# EAGLE design MeteoV4.0 (EAGLE 9.6.1)
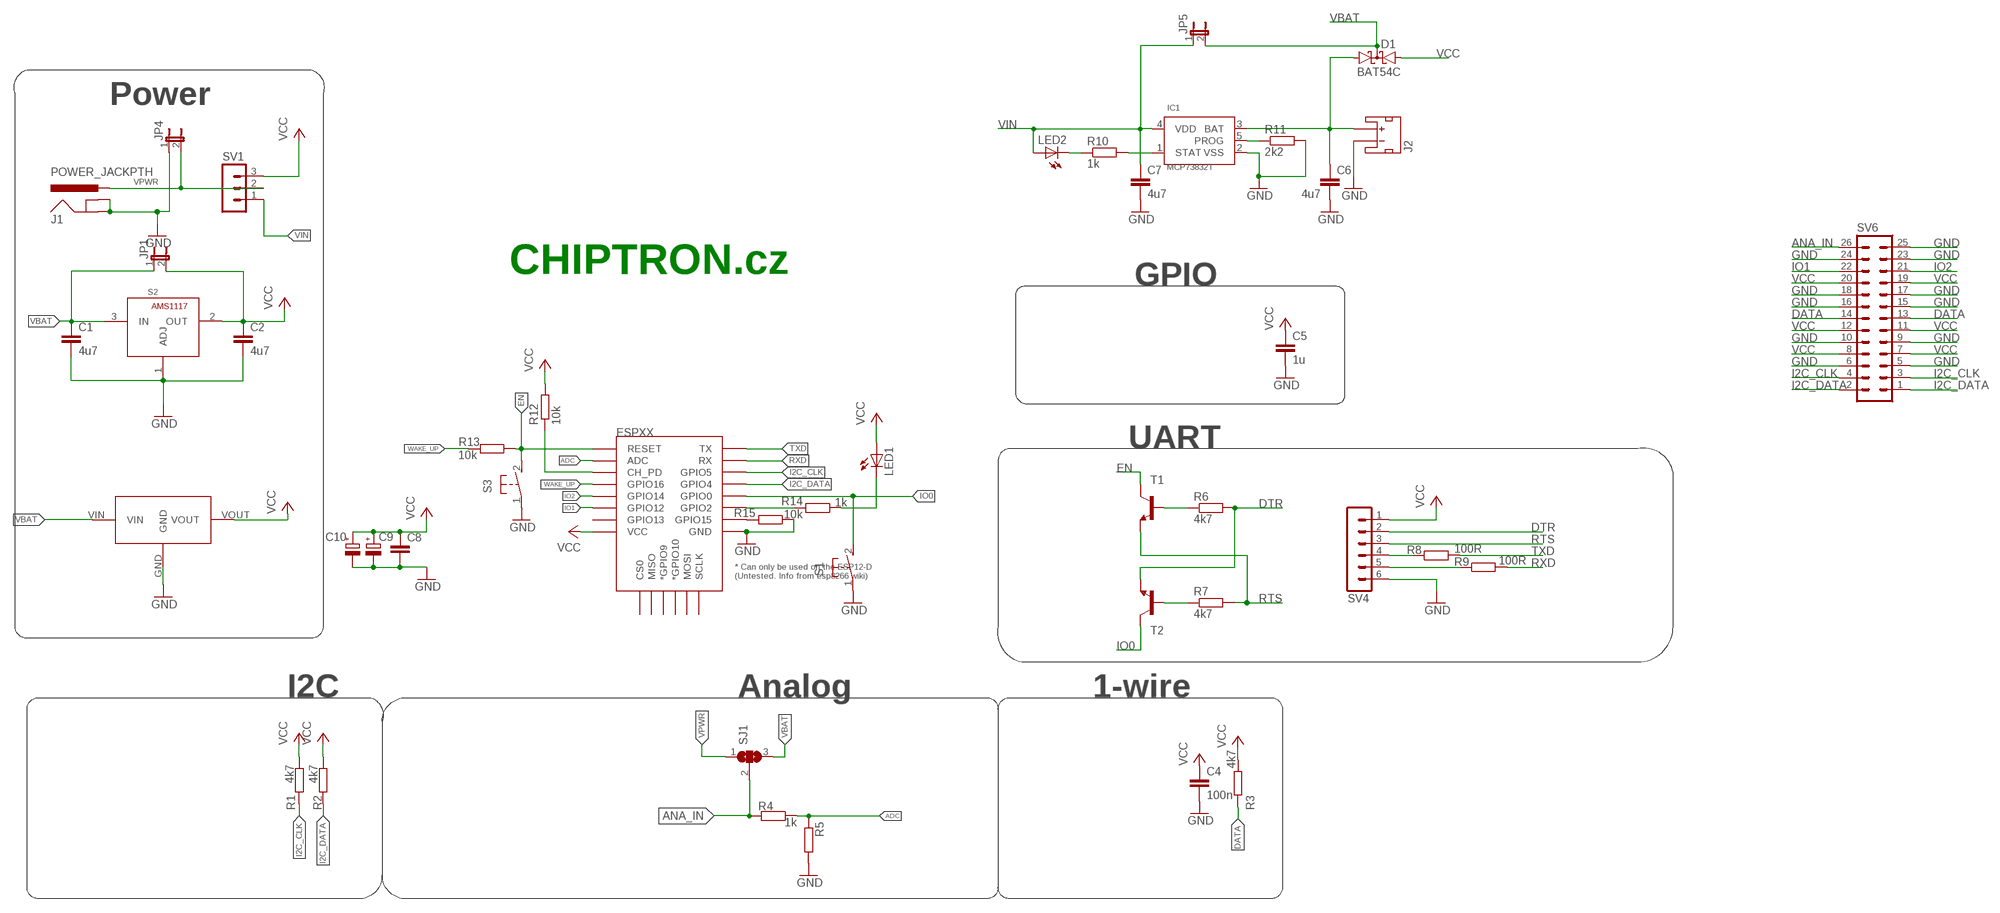
[diagram p0: schematic, sheet 1]

## Parts
C1  4u7  C-EUC0805  [C0805]
C2  4u7  C-EUC0805  [C0805]
C4  100n  C-EUC0805  [C0805]
C5  1u  C-EUC0805  [C0805]
C6  4u7  C-EUC0805  [C0805]
C7  4u7  C-EUC0805  [C0805]
C8  C-EUC0805  [C0805]
C9  CPOL-EUSMCB  [SMC_B]
C10  CPOL-EUSMCC  [SMC_C]
D1  BAT54C  [SOT23]
ESPXX  ESP12ESMD  [ESP12E-SMD]
IC1  MCP73832T  [SOT23-5]
J1  POWER_JACKPTH  [POWER_JACK_PTH]
J2  JST_2MM_MALE  [JST-2-SMD]
JP1  JP1E  [JP1]
JP4  JP1E  [JP1]
JP5  JP1E  [JP1]
LED1  LEDCHIP-LED0805  [CHIP-LED0805]
LED2  LEDCHIP-LED0805  [CHIP-LED0805]
R1  4k7  R-EU_M0805  [M0805]
R2  4k7  R-EU_M0805  [M0805]
R3  4k7  R-EU_M0805  [M0805]
R4  1k  R-EU_M0805  [M0805]
R5  R-EU_M0805  [M0805]
R6  4k7  R-EU_M0805  [M0805]
R7  4k7  R-EU_M0805  [M0805]
R8  100R  R-EU_M0805  [M0805]
R9  100R  R-EU_M0805  [M0805]
R10  1k  R-EU_M0805  [M0805]
R11  2k2  R-EU_M0805  [M0805]
R12  10k  R-EU_M0805  [M0805]
R13  10k  R-EU_M0805  [M0805]
R14  1k  R-EU_M0805  [M0805]
R15  10k  R-EU_M0805  [M0805]
S1  31-XX  [B3F-31XX]
S2  AMS1117  [SOT-223-3]
S3  31-XX  [B3F-31XX]
SJ1  SJ2W  [SJ_2]
SV1  MA03-1  [MA03-1]
SV4  MA06-1  [MA06-1]
SV6  MA13-2  [MA13-2]
T1  BC846-NPN-SOT23-BEC  [SOT23-BEC]
T2  BC846-NPN-SOT23-BEC  [SOT23-BEC]
U$1  HT7333  [SOT89]

## Nets
ADC: ESPXX.ADC R4.1 R5.1
ANA_IN: R4.2 SJ1.2 SV6.26
DATA: R3.1 SV6.13 SV6.14
DTR: R6.2 SV4.2 T2.E
EN: ESPXX.RESET R13.1 S3.2(S) T1.C
GND: C1.2 C2.2 C4.2 C5.2 C6.2 C7.2 C8.2 C9.- C10.- ESPXX.GND IC1.2(VSS) J1.GND J1.GNDBREAK J2.1(-) JP4.1 R5.2 R11.2 R15.1 S1.1(P) S2.1(ADJ) S3.1(P) SV4.6 SV6.5 SV6.6 SV6.9 SV6.10 SV6.15 SV6.16 SV6.17 SV6.18 SV6.23 SV6.24 SV6.25 U$1.GND
I2C_CLK: ESPXX.GPIO5 R1.1 SV6.3 SV6.4
I2C_DATA: ESPXX.GPIO4 R2.1 SV6.1 SV6.2
IO0: ESPXX.GPIO0 S1.2(S) T2.C
IO1: ESPXX.GPIO12 SV6.22
IO2: ESPXX.GPIO14 SV6.21
N$2: R7.1 T2.B
N$3: R8.1 SV4.4
N$4: R9.1 SV4.5
N$5: IC1.5(PROG) R11.1
N$7: ESPXX.CH_PD R12.1
N$8: LED1.C R14.1
N$9: ESPXX.GPIO15 R15.2
N$11: ESPXX.GPIO2 R14.2
N$12: R6.1 T1.B
N$14: IC1.1(STAT) R10.2
N$16: LED2.C R10.1
N$35: C6.1 D1.1(A1) IC1.3(BAT) J2.2(+)
RTS: R7.2 SV4.3 T1.E
RXD: ESPXX.RXD0(RX) R9.2
TXD: ESPXX.TXD0(TX) R8.2
VBAT: C1.1 D1.3(CC) JP1.1 JP5.2 S2.3(IN) SJ1.3 U$1.VIN
VCC: C2.1 C4.1 C5.1 C8.1 C9.+ C10.+ D1.2(A2) ESPXX.VCC JP1.2 LED1.A R1.2 R2.2 R3.2 R12.2 S2.2(OUT) SV1.3 SV4.1 SV6.7 SV6.8 SV6.11 SV6.12 SV6.19 SV6.20 U$1.VOUT
VIN: C7.1 IC1.4(VDD) JP5.1 LED2.A SV1.1
VPWR: J1.PWR JP4.2 SJ1.1 SV1.2
WAKE_UP: ESPXX.GPIO16 R13.2
Unconnected: ESPXX.CS0 ESPXX.GPIO9(*GPIO9) ESPXX.GPIO10(*GPIO10) ESPXX.GPIO13 ESPXX.MISO ESPXX.MOSI ESPXX.SCLK J2.NC1(PAD1) J2.NC2(PAD2)

## Notes on the sheet
- Power
- CHIPTRON.cz
- GPIO
- UART
- I2C | Analog | 1-wire

## Library data of the parts
C1 C2 C4-C8 = rcl:C-EU: CAPACITOR, European symbol; SPICEPREFIX: C
C9 C10 = rcl:CPOL-EU: POLARIZED CAPACITOR, European symbol; SPICEPREFIX: C
D1 = diode:BAT54C: Schottky Diodes Source: Fairchild .. BAT54.pdf
ESPXX = esp8266modules:ESP12E: ESP12E Module
IC1 = chiptron_cz:MCP73832T: MCP73832T
J1 = SparkFun:POWER_JACK: Power Jack This is the standard 5.5mm barrel jack for power. The PTH is the most common, proven, reliable, footprint. All others are experimental. The Slot footprint only works if the mill layer is transmitted to the PCB fab house so be warned. Spark Fun Electronics SKU : PRT-00119. Mating wall wart : TOL-00298 (and others)
J2 = SparkFun-connectors:JST_2MM_MALE: JST 2MM MALE RA CONNECTOR Two pin, compact surface mount connector. Commonly used as a battery input connection point. We really like the solid locking feeling and high current rating on these small connectors. We use these all the time as battery connectors. Mates to single-cell LiPo batteries. Here is the connector we sell at SparkFun: JST Right Angle Connector - White <https://www.sparkfun.com/products/8612> (PRT-08612) Datasheet <http://www.sparkfun.com/datasheets/Prototyping/Connectors/JST-Horizontal.pdf> It was used on these SparkFun products: SparkFun MOSFET Power Controller <https://www.sparkfun.com/products/11214> (PRT-11214) SparkFun Battery Babysitter - LiPo Battery Manager <https://www.sparkfun.com/products/13777> (PRT-13777) And many, many others that required a lipo battery connection.; PROD_ID: CONN-11443; SF_ID: PRT-08612
JP1 JP4 JP5 = jumper:JP1E: JUMPER
LED1 LED2 = adafruit:LED: LED OSRAM: - CHIPLED LG R971, LG N971, LY N971, LG Q971, LY Q971, LO R971, LY R971 LH N974, LH R974 LS Q976, LO Q976, LY Q976 LO Q996 - Hyper CHIPLED LW Q18S LB Q993, LB Q99A, LB R99A - SideLED LS A670, LO A670, LY A670, LG A670, LP A670 LB A673, LV A673, LT A673, LW A673 LH A674 LY A675 LS A676, LA A676, LO A676, LY A676, LW A676 LS A679, LY A679, LG A679 - Hyper Micro SIDELED® LS Y876, LA Y876, LO Y876, LY Y876 LT Y87S - SmartLED LW L88C, LW L88S LB L89C, LB L89S, LG L890 LS L89K, LO L89K, LY L89K LS L896, LA L896, LO L896, LY L896 - TOPLED LS T670, LO T670, LY T670, LG T670, LP T670 LSG T670, LSP T670, LSY T670, LOP T670, LYG T670 LG T671, LOG T671, LSG T671 LB T673, LV T673, LT T673, LW T673 LH T674 LS T676, LA T676, LO T676, LY T676, LB T676, LH T676, LSB T676, LW T676 LB T67C, LV T67C, LT T67C, LS T67K, LO T67K, LY T67K, LW E67C LS E67B, LA E67B, LO E67B, LY E67B, LB E67C, LV E67C, LT E67C LW T67C LS T679, LY T679, LG T679 LS T770, LO T770, LY T770, LG T770, LP T770 LB T773, LV T773, LT T773, LW T773 LH T774 LS E675, LA E675, LY E675, LS T675 LS T776, LA T776, LO T776, LY T776, LB T776 LHGB T686 LT T68C, LB T68C - Hyper Mini TOPLED® LB M676 - Mini TOPLED Santana® LG M470 LS M47K, LO M47K, LY M47K Source: http://www.osram.convergy.de/
R1-R15 = rcl:R-EU_: RESISTOR, European symbol; SPICEPREFIX: R
S1 S3 = switch-omron:31-XX: OMRON SWITCH; MPN: B3F-3100; OC_FARNELL: 959704; OC_NEWARK: 36M3582
S2 = fabo_powersupply:AMS1117
SJ1 = jumper:SJ2W: SMD solder JUMPER
SV1 = con-lstb:MA03-1: PIN HEADER; OC_FARNELL: unknown; OC_NEWARK: unknown
SV4 = con-lstb:MA06-1: PIN HEADER; OC_FARNELL: unknown; OC_NEWARK: unknown
SV6 = con-lstb:MA13-2: PIN HEADER; OC_FARNELL: unknown; OC_NEWARK: unknown
T1 T2 = transistor:*-NPN-: NPN Transistror BF959 corrected 2008.03.06
U$1 = HT7333_SOT89:HT7333

## Board
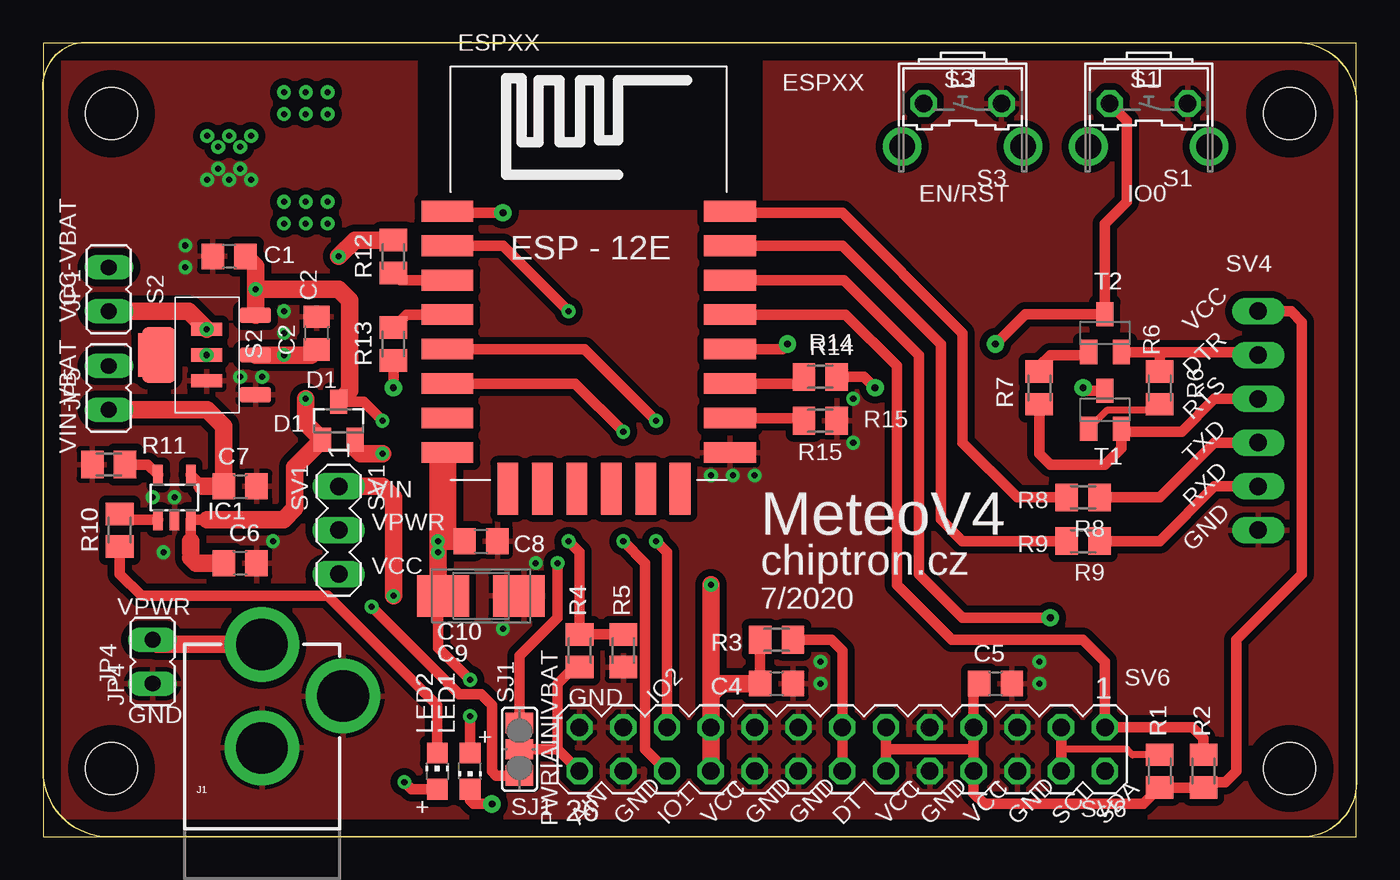
[diagram p1: board, top side]
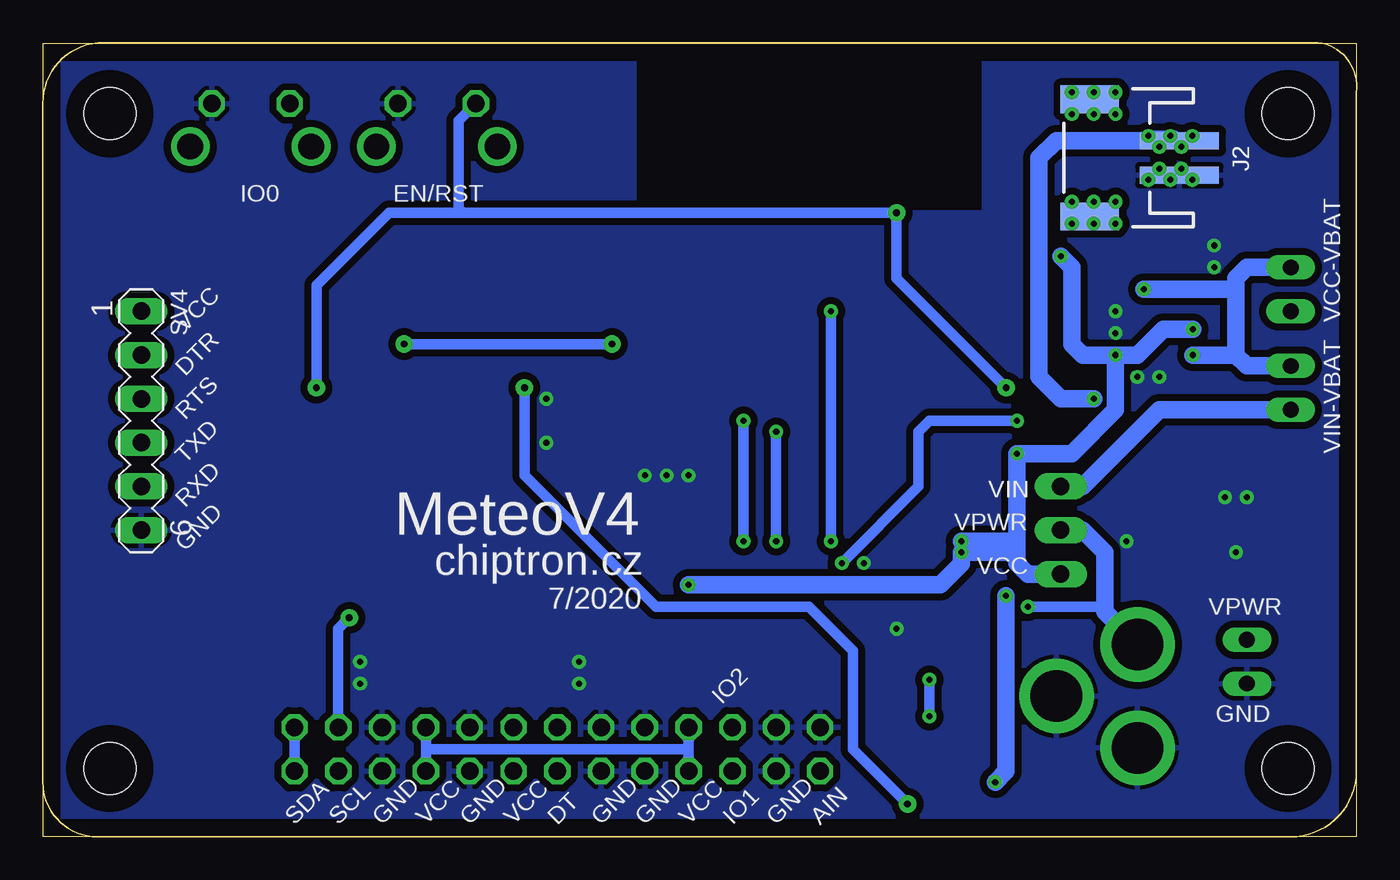
[diagram p2: board, bottom side, seen from below]

Size 76.18 x 46.02 mm. Coordinates in mm from the lower left corner, seen from the top.
Outline: 0,0 76.18,0 76.18,46.02 0,46.02 0,0
Copper layers (1*16): Top 0.035mm / dielectric 1.5mm / Bottom 0.035mm
Design rules "default": minimum track width 6mil, minimum drill 0.35mm, track to track 6mil, track to pad 6mil, pad to pad 6mil, via to via 6mil, smd to smd 6mil, copper to edge 40mil, drill to drill 6mil, minimum pad ring 10mil, minimum via ring 8mil, stop-mask expansion 4mil, vias tented up to drill 0mil, thermal gap 10mil
Holes 3 mm at 3.96,3.96 72.31,3.96 3.96,41.94 72.31,41.94
Milling: 8 lines

### Footprints (pad centres in the part's own frame; a part is rotated, then mirrored left to right if it is on the bottom)
C0805 = smd 1.3 x 1.5: 1 -0.95,0; 2 0.95,0
SMC_B = smd 1.6 x 2.4: + -1.5,0; - 1.5,0
SMC_C = smd 2.4 x 2.4: + -2.5,0; - 2.5,0
SOT23 = smd 1 x 1.4: 1 -0.95,-1.1; 2 0.95,-1.1; 3 0,1.1
ESP12E-SMD = smd 3 x 1.2: ADC -8.3,3.8; CH_PD -8.3,1.8; GND 8.1,-8.2; GPIO0 8.1,-2.2; GPIO2 8.1,-4.2; GPIO4 8.1,-0.2; GPIO5 8.1,1.8; GPIO12 -8.3,-4.2; GPIO13 -8.3,-6.2; GPIO14 -8.3,-2.2; GPIO15 8.1,-6.2; GPIO16 -8.3,-0.2; RESET -8.3,5.8; RXD0 8.1,3.8; TXD0 8.1,5.8; VCC -8.3,-8.2 | smd 1.2 x 3: CS0 -4.8,-10.3; GPIO9 -0.8,-10.3; GPIO10 1.2,-10.3; MISO -2.8,-10.3; MOSI 3.2,-10.3; SCLK 5.2,-10.3
SOT23-5 = smd 0.55 x 1.2: 1 -0.95,-1.3; 2 0,-1.3; 3 0.95,-1.3; 4 0.95,1.3; 5 -0.95,1.3
POWER_JACK_PTH = drill 2.997 pad 4.318: GND 0,7.7; GNDBREAK 4.7,10.7; PWR 0,13.7
JST-2-SMD = smd 1 x 4.6: 1 -1,-3.7; 2 1,-3.7 | smd 1.6 x 3.4: NC1 -3.4,1.5; NC2 3.4,1.5
JP1 = drill 0.914 long: 1 0,-1.27; 2 0,1.27
CHIP-LED0805 = smd 1.2 x 1.2: A 0,-1.05; C 0,1.05
M0805 = smd 1.3 x 1.6: 1 -0.95,0; 2 0.95,0
B3F-31XX = drill 1.016 octagon: 1 -2.261,-1.245; 2 2.261,-1.245 | drill 1.499 pad 2.159: 3 -3.505,1.245; 4 3.505,1.245
SOT-223-3 = smd 0.9 x 1.8: 1 -2.3,-2.8; 2 0,-2.8; 3 2.3,-2.8 | smd 3.2 x 1.9: 4 0,2.8
SJ_2 = smd 1.168 x 1.6: 1 -1.524,0; 2 0,0; 3 1.524,0
MA03-1 = drill 1.016 long: 1 -2.54,0; 2 0,0; 3 2.54,0
MA06-1 = drill 1.016 long: 1 -6.35,0; 2 -3.81,0; 3 -1.27,0; 4 1.27,0; 5 3.81,0; 6 6.35,0
MA13-2 = drill 1.016 octagon: 1 -15.24,-1.27; 2 -15.24,1.27; 3 -12.7,-1.27; 4 -12.7,1.27; 5 -10.16,-1.27; 6 -10.16,1.27; 7 -7.62,-1.27; 8 -7.62,1.27; 9 -5.08,-1.27; 10 -5.08,1.27; 11 -2.54,-1.27; 12 -2.54,1.27; 13 0,-1.27; 14 0,1.27; 15 2.54,-1.27; 16 2.54,1.27; 17 5.08,-1.27; 18 5.08,1.27; 19 7.62,-1.27; 20 7.62,1.27; 21 10.16,-1.27; 22 10.16,1.27; 23 12.7,-1.27; 24 12.7,1.27; 25 15.24,-1.27; 26 15.24,1.27
SOT23-BEC = smd 1 x 1.4: B -0.95,-1.1; C 0,1.1; E 0.95,-1.1
SOT89 = smd 0.762 x 1.778: GND -1.499,-0.597; VIN 0,-0.597; VOUT 1.499,-0.597 | smd 2.54 x 1.27: P$4 0,2.743

### Placement (x,y rotation side)
C1  10.79,33.66 180 top
C2  15.88,29.21 90 top
C4  42.55,8.89 0 top
C5  55.24,8.89 0 top
C6  11.43,15.88 0 top
C7  11.43,20.32 0 top
C8  25.4,17.14 0 top
C9  25.4,13.97 0 top
C10  25.4,13.97 0 top
D1  17.14,24.13 0 top
ESPXX  31.75,30.48 0 top
IC1  7.62,19.68 0 top
J1  12.7,-2.54 0 top
J2  13.97,39.37 90 bottom
JP1  3.81,31.75 180 top
JP4  6.35,10.16 0 top
JP5  3.81,26.04 0 top
LED1  24.77,3.81 180 top
LED2  22.86,3.81 0 top
R1  64.77,3.81 270 top
R2  67.31,3.81 270 top
R3  42.55,11.43 180 top
R4  31.11,10.79 270 top
R5  33.66,10.79 270 top
R6  64.77,26.04 90 top
R7  57.78,26.04 270 top
R8  60.33,19.68 180 top
R9  60.33,17.14 180 top
R10  4.45,17.78 90 top
R11  3.81,21.59 180 top
R12  20.32,33.66 90 top
R13  20.32,28.57 90 top
R14  45.09,26.67 180 top
R15  45.09,24.13 180 top
S1  64.14,41.27 180 top
S2  9.53,27.94 90 top
S3  53.34,41.27 180 top
SJ1  27.64,5.08 90 top
SV1  17.14,17.78 270 top
SV4  70.48,24.13 270 bottom
SV6  46.35,5.08 180 top
T1  61.59,24.77 0 top
T2  61.59,29.21 0 top
U$1  8.89,27.94 90 top

### Tracks (layer width: path | path; a pad name or v marks a point on that pad's centre or on a via)
ADC  (via drill 0.35 pad 0.8)
  Top 0.61: R5.1 R4.1 31.11,16.51 v30.48,17.14 | ESPXX.ADC 26.68,34.28 v30.48,30.48
  Bottom 0.61: v30.48,30.48 v30.48,17.14
ANA_IN
  Top 0.61: SJ1.2 29.84,5.08 | 29.84,5.08 SV6.26 | R4.2 30.8,9.85 29.84,8.89 29.84,5.08
DATA
  Top 0.61: SV6.14 SV6.13 46.35,10.79 45.72,11.43 R3.1
DTR
  Top 0.61: T2.E 64.77,28.11 | 64.77,28.11 70.31,28.11 SV4.2 | R6.2 64.77,28.11
EN  (via drill 0.4 pad 1)
  Top 0.61: R13.1 v20.32,26.04 | v26.67,36.2 23.54,36.2 ESPXX.RESET | T1.C 60.49,25.86 v60.33,26.04
  Bottom 0.61: v20.32,26.04 26.67,32.38 v26.67,36.2 51.82,36.2 | 51.82,36.2 56.11,36.2 60.33,31.98 v60.33,26.04 | 51.82,36.2 52.07,36.45 52.07,41.53 S3.2
GND  (via drill 0.35 pad 0.8)
  other vias: 9.53,38.1 10.79,38.1 12.06,38.1 11.43,38.73 10.16,38.73 45.09,8.89 57.78,8.89 46.99,25.4 46.99,22.86 38.73,20.95 40.01,20.95 41.27,20.95 26.67,12.06 8.26,33.02 8.26,34.29 13.97,30.48 13.97,29.21 12.7,26.67 11.43,26.67 7.62,19.68 6.35,19.68 6.99,16.51 13.34,17.14 28.57,15.88 57.78,10.16 45.09,10.16
  pour Top (isolate 0.406): 0,45.72 20.95,45.72 21.59,45.09 21.59,36.2 41.91,36.2 41.91,45.09 42.55,45.72 76.2,45.72 76.2,0 0,0
  pour Bottom (isolate 0.406): 0,45.72 20.95,45.72 21.59,45.09 21.59,36.2 41.91,36.2 41.91,45.09 42.55,45.72 76.2,45.72 76.2,0 0,0
I2C_CLK  (via drill 0.4 pad 1)
  Top 0.406: R1.1 63.19,4.76 62.87,5.08 59.05,5.08
  Top 0.61: ESPXX.GPIO5 46.46,32.28 50.8,27.94 50.8,15.24 53.34,12.7 v58.42,12.7 | SV6.4 59.05,5.08 SV6.3
  Bottom 0.61: v58.42,12.7 59.05,12.06 SV6.3
I2C_DATA
  Top 0.61: ESPXX.GPIO4 46.55,30.28 49.53,27.3 49.53,14.61 52.7,11.43 60.33,11.43 61.59,10.16 SV6.1 66.67,6.35 67.31,5.71 R2.1
  Bottom 0.61: SV6.2 SV6.1
IO0  (via drill 0.4 pad 1)
  Top 0.61: S1.2 62.87,41.53 62.87,36.83 61.59,35.56 T2.C 56.98,30.31 v55.24,28.57 | ESPXX.GPIO0 42.88,28.28 v43.18,28.57
  Bottom 0.61: v43.18,28.57 v55.24,28.57
IO1  (via drill 0.35 pad 0.8)
  Top 0.61: ESPXX.GPIO12 30.87,26.28 v33.66,23.5 | v33.66,17.14 34.92,15.88 34.92,5.08 SV6.22
  Bottom 0.61: v33.66,23.5 v33.66,17.14
IO2  (via drill 0.35 pad 0.8)
  Top 0.61: ESPXX.GPIO14 31.41,28.28 v35.56,24.13 | v35.56,17.14 36.2,16.51 SV6.21
  Bottom 0.61: v35.56,24.13 v35.56,17.14
N$1  (via drill 0.35 pad 0.8)
  other vias: 13.97,43.18
N$2
  Top 0.61: T2.B 60.48,27.94 58.42,27.94 57.78,27.3 R7.1
N$3
  Top 0.61: SV4.4 67.94,22.86 64.77,19.68 R8.1
N$4
  Top 0.61: R9.1 62.23,17.14 62.55,17.14 64.77,17.14 67.94,20.32 SV4.5
N$5
  Top 0.61: IC1.5 6.07,21.59 R11.1
N$6  (via drill 0.35 pad 0.8)
  other vias: 13.97,41.91
N$7
  Top 0.61: ESPXX.CH_PD 20.75,32.28 R12.1
N$8  (via drill 0.4 pad 1)
  Top 0.61: v26.04,1.91 24.98,1.91 24.77,2.12 LED1.C | v48.26,26.04 47.62,26.67 R14.1
  Bottom 0.61: v26.04,1.91 29.21,5.08 29.21,10.79 31.75,13.34 40.64,13.34 48.26,20.95 v48.26,26.04
N$9
  Top 0.61: ESPXX.GPIO15 43.98,24.28 R15.2
N$11
  Top 0.61: ESPXX.GPIO2 43.74,26.28 R14.2
N$12
  Top 0.406: T1.B 61.74,24.77 64.45,24.77 R6.1
N$14
  Top 0.61: IC1.1 4.79,18.39 R10.2
N$16
  Top 0.61: R10.1 4.45,15.24 5.71,13.97 16.51,13.97 22.86,7.62 LED2.C
N$17  (via drill 0.35 pad 0.8)
  other vias: 15.24,43.18
N$18  (via drill 0.35 pad 0.8)
  other vias: 15.24,41.91
N$19  (via drill 0.35 pad 0.8)
  other vias: 16.51,41.91
N$20  (via drill 0.35 pad 0.8)
  other vias: 16.51,43.18
N$21  (via drill 0.35 pad 0.8)
  other vias: 15.24,36.83
N$22  (via drill 0.35 pad 0.8)
  other vias: 16.51,36.83
N$23  (via drill 0.35 pad 0.8)
  other vias: 16.51,35.56
N$24  (via drill 0.35 pad 0.8)
  other vias: 15.24,35.56
N$25  (via drill 0.35 pad 0.8)
  other vias: 13.97,35.56
N$26  (via drill 0.35 pad 0.8)
  other vias: 13.97,36.83
N$35  (via drill 0.35 pad 0.8)
  Top 0.61: 8.57,17.14 IC1.3 9.53,18.39 | 8.57,16.2 8.57,16.51
  Top 1.016: 8.57,16.2 8.89,15.88 C6.1 | v15.24,25.4 15.24,23.98 D1.1 14.61,21.44 14.61,19.05 13.94,18.39 9.53,18.39 | 8.57,16.51 8.57,17.14
  Bottom 0.61: J2.2 10.54,40.64 v10.79,40.64 v12.06,40.64 | J2.2 10.27,40.12 v10.16,40.01 | J2.2 9.79,40.37 v9.53,40.64 | J2.2 11.06,40.37 v11.43,40.01
  Bottom 1.016: J2.2 17.41,40.37 18.41,39.37 18.41,26.67 17.14,25.4 v15.24,25.4
RTS
  Top 0.61: R7.2 57.78,22.23 58.42,21.59 61.59,21.59 62.55,22.54 T1.E 62.72,23.5 66.04,23.5 67.94,25.4 SV4.3
RXD
  Top 0.61: ESPXX.RXD0 46.37,34.28 52.07,28.57 52.07,18.41 53.34,17.14 R9.2
TXD
  Top 0.61: R8.2 56.52,19.68 53.34,22.86 53.34,29.21 46.35,36.2 39.94,36.2 ESPXX.TXD0
VBAT  (via drill 0.35 pad 0.8)
  Top 0.61: D1.3 18.59,25.23 v19.68,24.13 | v29.84,15.88 29.84,12.7 27.64,10.49 SJ1.3
  Top 1.016: S2.3 v12.32,31.75 | v12.32,31.75 12.32,33.08 C1.1 | D1.3 17.78,25.86 17.78,31.11 17.14,31.75 v12.32,31.75
  Bottom 0.61: v19.68,24.13 24.77,24.13 25.4,23.5 25.4,20.32 v29.84,15.88
  Bottom 1.016: JP5.2 6.35,27.3 6.99,27.94 | 6.99,27.94 6.99,31.75 | 6.99,31.75 6.99,32.38 6.35,33.02 JP1.1 | U$1.VIN 6.99,27.94 | v12.32,31.75 6.99,31.75
  other vias: 9.49,27.94
VCC  (via drill 0.35 pad 0.8)
  Top 0.61: C5.1 53.98,8.57 SV6.7 53.98,5.08 | SV6.12 48.9,5.08 | 48.9,5.08 SV6.11 | C4.1 R3.2 | 53.98,5.08 SV6.8 53.98,2.54 54.61,1.91 63.81,1.91 R1.2 R2.2 67.62,3.17 68.58,3.17 69.22,3.81 69.22,11.43 73.03,15.24 73.03,29.84 72.39,30.48 SV4.1 | 53.98,5.08 48.9,5.08 | 15.71,28.1 15.55,27.94 | ESPXX.VCC 23.39,22.23 | v24.77,6.99 LED1.A | v24.77,9.11 22.9,10.98 C10.+
  Top 1.016: U$1.VOUT 8.45,30.48 JP1.2 | v19.68,22.23 18.41,22.23 18.09,22.55 D1.2 | R12.2 18.09,34.6 v17.14,33.66 | v22.9,17.14 22.9,17.78 | 22.9,17.78 22.9,21.73 23.39,22.23 | C8.1 23.5,17.14 | 23.5,17.14 v22.9,17.14 | v22.9,17.14 v22.9,16.51 C10.+ C9.+ | S2.2 v13.97,27.94 15.55,27.94 | C2.1 15.71,28.1 | ESPXX.VCC 23.45,18.33 | 23.45,18.33 22.9,17.78 | 23.45,18.33 23.45,17.19 23.5,17.14 | v38.73,14.61 38.73,8.26 | C4.1 39.37,8.89 38.73,8.26 | 38.73,8.26 SV6.19 SV6.20
  Bottom 0.61: SV6.8 53.98,5.08 | 53.98,5.08 SV6.7 | 53.98,5.08 38.73,5.08 | 38.73,5.08 SV6.19 | SV6.20 38.73,5.08 | v24.77,6.99 v24.77,9.11
  Bottom 1.016: v13.97,27.94 12.7,27.94 11.2,29.44 U$1.VOUT | v13.97,27.94 13.97,24.77 16.51,22.23 v19.68,22.23 19.68,17.14 | SV1.3 19.05,15.24 19.68,15.88 19.68,16.51 | 19.68,17.14 19.68,16.51 | v17.14,33.66 16.51,33.02 16.51,28.57 15.88,27.94 v13.97,27.94 | 19.68,16.51 v22.9,16.51 | 19.68,17.14 v22.9,17.14 | 19.68,17.14 20.32,16.51 v22.9,16.51 | v22.9,16.51 22.9,15.84 24.13,14.61 v38.73,14.61
  other vias: 9.49,29.44
VIN  (via drill 0.35 pad 0.8)
  Top 0.61: LED2.A 21.37,2.76 v20.95,3.17 | 9.23,20.32 IC1.4
  Top 1.016: v20.32,13.97 20.32,19.68 19.68,20.32 SV1.1 | JP5.1 9.53,24.77 10.48,23.81 C7.1 9.23,20.32
  Bottom 1.016: JP5.1 11.43,24.77 15.88,20.32 SV1.1 | v20.32,13.97 20.32,3.81 v20.95,3.17
VPWR  (via drill 0.35 pad 0.8)
  Top 0.61: 6.62,11.16 JP4.2 | SJ1.1 26.29,3.56 26.04,3.81 26.04,7.62 25.4,8.26 24.13,8.26 v19.05,13.34
  Top 1.016: J1.PWR 6.62,11.16
  Bottom 0.61: v19.05,13.34 14.61,13.34
  Bottom 1.016: J1.PWR 14.61,13.06 14.61,13.34 14.61,16.51 15.88,17.78 SV1.2
WAKE_UP
  Top 0.61: ESPXX.GPIO16 21.07,30.28 R13.2

### Text on the board
_tNames: S3 | S1 | ESPXX | EN/RST | IO0 | C1 | SV4 | S2 | R12 | T2 | C2 | VCC-VBAT | VCC | R14 | R6 | R13 | R7 | DTR | RTS | D1 | R15 | VIN-VBAT | R11 | C7 | SV1 | T1 | TXD | VIN | R8 | RXD | IC1 | VPWR | MeteoV4 | R10 | C6 | C8 | R9 | GND | VCC | R4 | R5 | chiptron.cz | VPWR | 7/2020 | JP4 | C10 | R3 | LED2 | C9 | LED1 | C5 | SV6 | SJ1 | GND | IO2 | C4 | R1 | R2 | GND | J1 | PWR|AIN|VBAT | AIN | GND | IO1 | VCC | GND | GND | DT | VCC | GND | VCC | GND | SCL | SDA
_bNames: J2 | EN/RST | IO0 | VCC-VBAT | VCC | DTR | RTS | VIN-VBAT | TXD | VIN | RXD | VPWR | MeteoV4 | GND | VCC | chiptron.cz | VPWR | 7/2020 | IO2 | GND | AIN | GND | IO1 | VCC | GND | GND | DT | VCC | GND | VCC | GND | SCL | SDA